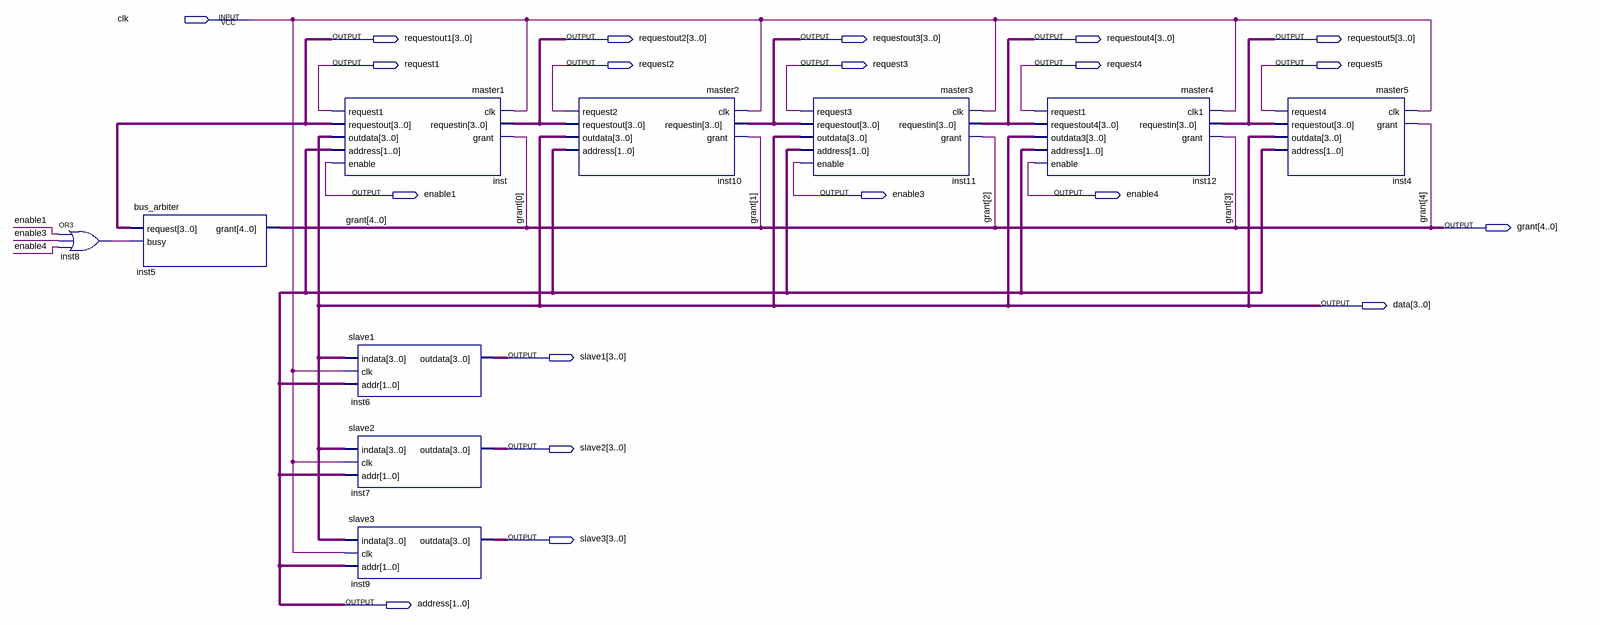
[diagram p0: schematic sheet]
// Quartus schematic Block1.bdf as structural Verilog: 10 symbols, 20 pins
module Block1 (
  input  clk,
  output [3:0] requestout1,
  output [3:0] requestout2,
  output [3:0] requestout3,
  output [3:0] requestout4,
  output [3:0] requestout5,
  output request1,
  output request2,
  output request3,
  output request4,
  output request5,
  output enable1,
  output enable3,
  output enable4,
  output [4:0] grant,
  output [3:0] data,
  output [3:0] slave1,
  output [3:0] slave2,
  output [3:0] slave3,
  output [1:0] address
);

  wire inst8_out;

  or inst8 (inst8_out, enable1, enable3, enable4);
  bus_arbiter inst5 (.request(requestout1), .busy(inst8_out), .grant(grant));
  master1 inst (
    .clk(clk), .requestin(requestout2), .grant(grant[0]), .request1(request1), .requestout(requestout1),
    .outdata(data), .address(address), .enable(enable1));
  slave1 inst6 (.indata(data), .clk(clk), .addr(address), .outdata(slave1));
  slave2 inst7 (.indata(data), .clk(clk), .addr(address), .outdata(slave2));
  slave3 inst9 (.indata(data), .clk(clk), .addr(address), .outdata(slave3));
  master2 inst10 (
    .clk(clk), .requestin(requestout3), .grant(grant[1]), .request2(request2), .requestout(requestout2),
    .outdata(data), .address(address));
  master3 inst11 (
    .clk(clk), .requestin(requestout4), .grant(grant[2]), .request3(request3), .requestout(requestout3),
    .outdata(data), .address(address), .enable(enable3));
  master4 inst12 (
    .clk1(clk), .requestin(requestout5), .grant(grant[3]), .request1(request4), .requestout4(requestout4),
    .outdata3(data), .address(address), .enable(enable4));
  master5 inst4 (
    .clk(clk), .grant(grant[4]), .request4(request5), .requestout(requestout5), .outdata(data),
    .address(address));
endmodule
